# Altium schematic sheet Micro.SchDoc
size A; SheetNumber: 2; SheetTotal: 3
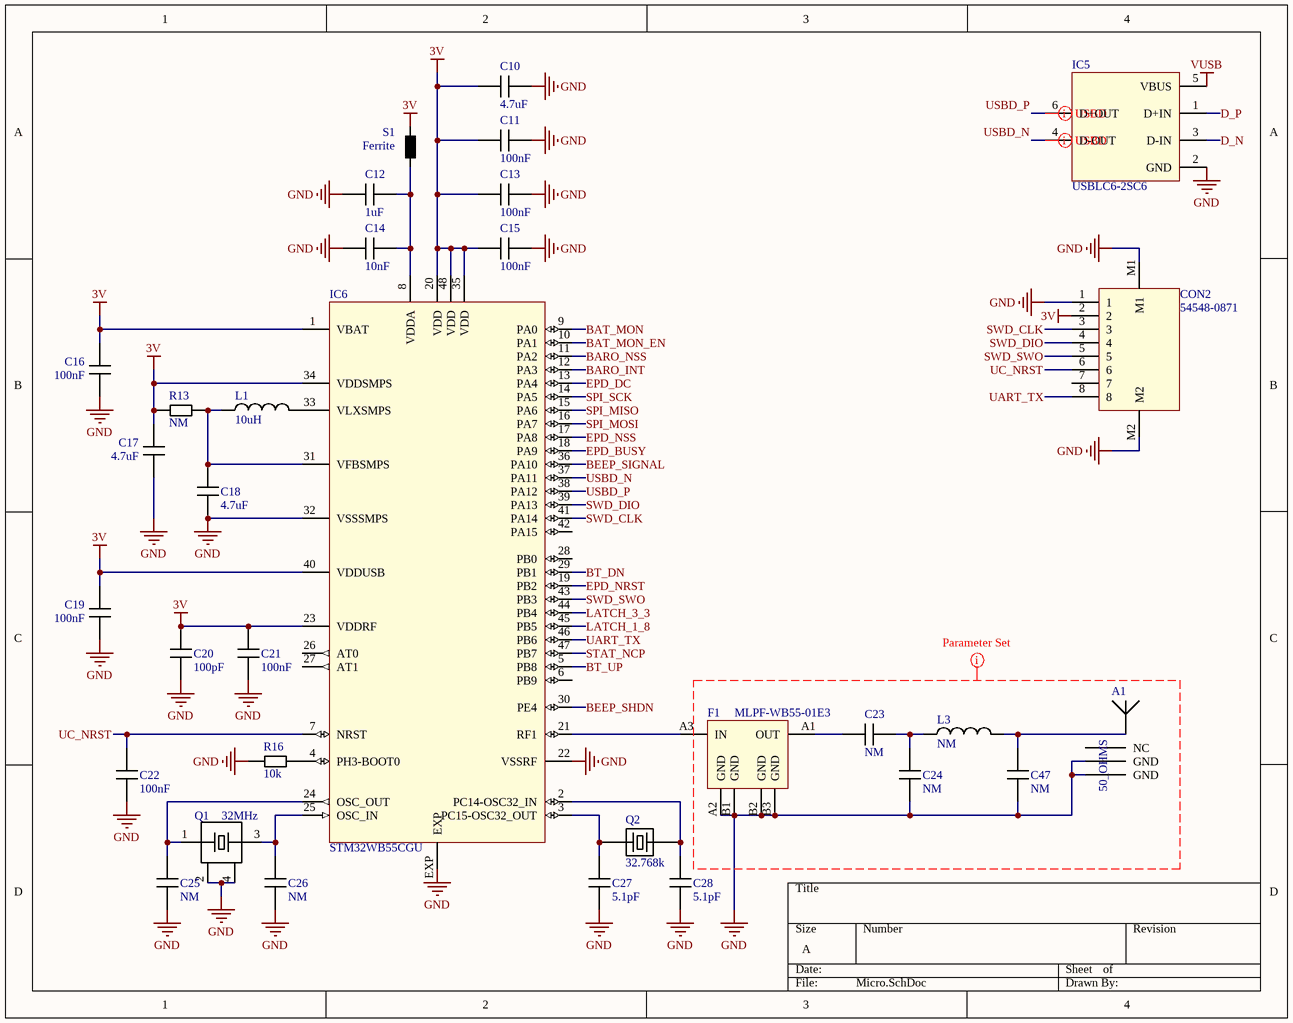
[diagram p0: Micro.SchDoc]

## Parts
A1  value 50_OHMS  [2450AT42E0100]  (hidden comment: 2450AT42E0100)
C10  value 4.7uF  [C0402]  (hidden comment: 4.7uF (0402) AEC-Q200)
C11  value 100nF  [C0402]  (hidden comment: 100nF (0402) AEC-Q200)
C12  value 1uF  [C0402]  (hidden comment: 1uF (0402))
C13  value 100nF  [C0402]  (hidden comment: 100nF (0402) AEC-Q200)
C14  value 10nF  [C0402]  (hidden comment: 10nF (0402) AEC-Q200)
C15  value 100nF  [C0402]  (hidden comment: 100nF (0402) AEC-Q200)
C16  value 100nF  [C0402]  (hidden comment: 100nF (0402) AEC-Q200)
C17  value 4.7uF  [C0402]  (hidden comment: 4.7uF (0402) AEC-Q200)
C18  value 4.7uF  [C0402]  (hidden comment: 4.7uF (0402) AEC-Q200)
C19  value 100nF  [C0402]  (hidden comment: 100nF (0402) AEC-Q200)
C20  value 100pF  [C0402]  (hidden comment: 100pF (0402) AEC-Q200)
C21  value 100nF  [C0402]  (hidden comment: 100nF (0402) AEC-Q200)
C22  value 100nF  [C0402]  (hidden comment: 100nF (0402) AEC-Q200)
C23  value NM  [C0402 (NM)]  (hidden comment: NM (0402))
C24  value NM  [C0402 (NM)]  (hidden comment: NM (0402))
C25  value NM  [C0402 (NM)]  (hidden comment: NM (0402))
C26  value NM  [C0402 (NM)]  (hidden comment: NM (0402))
C27  value 5.1pF  [C0402]  (hidden comment: 5.1pF (0402) AEC-Q200)
C28  value 5.1pF  [C0402]  (hidden comment: 5.1pF (0402) AEC-Q200)
C47  value NM  [C0402 (NM)]  (hidden comment: NM (0402))
CON2  54548-0871  [54548-0871]
F1  MLPF-WB55-01E3  [MLPF-WB-01E3]
IC5  value USBLC6-2SC6  [SOT23-6]  (hidden comment: USBLC6-2)
IC6  STM32WB55CGU  [UFQFPN48]
L1  value 10uH  [2.5x2 (2512)]  (hidden comment: 10uH (2.5x2) AEC-Q200)
L3  value NM  [S0402 (NM)]  (hidden comment: NM (0402))
Q1  value 32MHz  [2.0x1.6 - ECS-320-8-47Q]  (hidden comment: ECS-320-8-47Q-CES-TR)
Q2  value 32.768k  [3.2x1.5]  (hidden comment: ECS-.327-12.5-34QCS-TR)
R13  value NM  [R0402 (NM)]  (hidden comment: NM (0402))
R16  value 10k  [R0402]  (hidden comment: 10k (0402) AEC-Q200)
S1  value Ferrite  [0402 (FERRITE)]  (hidden comment: Ferrite (0402) 1k AEC-Q200)

## Nets
3V: C10.2 C11.1 C13.1 C15.1 C16.1 C17.2 C19.1 C20.1 C21.1 CON2.2 IC6.1(VBAT) IC6.20(VDD) IC6.23(VDDRF) IC6.34(VDDSMPS) IC6.35(VDD) IC6.40(VDDUSB) IC6.48(VDD) R13.1 S1.2
GND: A1.3(GND) A1.4(GND) C10.1 C11.2 C12.1 C13.2 C14.2 C15.2 C16.2 C17.1 C18.1 C19.2 C20.2 C21.2 C22.2 C24.2 C25.2 C26.2 C27.2 C28.2 C47.2 CON2.1 CON2.M1 CON2.M2 F1.A2(GND) F1.B1(GND) F1.B2(GND) F1.B3(GND) IC5.2(GND) IC6.22(VSSRF) IC6.32(VSSSMPS) IC6.EXP Q1.2 Q1.4 R16.1
VUSB: IC5.5(VBUS)
BARO_INT: IC6.12(PA3)
BARO_NSS: IC6.11(PA2)
BAT_MON: IC6.9(PA0)
BAT_MON_EN: IC6.10(PA1)
BEEP_SHDN: IC6.30(PE4)
BEEP_SIGNAL: IC6.36(PA10)
BT_DN: IC6.29(PB1)
BT_UP: IC6.5(PB8)
D_N: IC5.3(D-IN)
D_P: IC5.1(D+IN)
EPD_BUSY: IC6.18(PA9)
EPD_DC: IC6.13(PA4)
EPD_NRST: IC6.19(PB2)
EPD_NSS: IC6.17(PA8)
LATCH_1_8: IC6.45(PB5)
LATCH_3_3: IC6.44(PB4)
SPI_MISO: IC6.15(PA6)
SPI_MOSI: IC6.16(PA7)
SPI_SCK: IC6.14(PA5)
STAT_NCP: IC6.47(PB7)
SWD_CLK: CON2.3 IC6.41(PA14)
SWD_DIO: CON2.4 IC6.39(PA13)
SWD_SWO: CON2.5 IC6.43(PB3)
UART_TX: CON2.8 IC6.46(PB6)
UC_NRST: C22.1 CON2.6 IC6.7(NRST)
USBD_N: IC5.4(D-OUT) IC6.37(PA11)
USBD_P: IC5.6(D+OUT) IC6.38(PA12)
NetA1_1: A1.1 C47.1 L3.2
NetC12_2: C12.2 C14.1 IC6.8(VDDA) S1.1
NetC18_2: C18.2 IC6.31(VFBSMPS) L1.1 R13.2
NetC23_1: C23.1 F1.A1(OUT)
NetC23_2: C23.2 C24.1 L3.1
NetC25_1: C25.1 IC6.24(OSC_OUT) Q1.1(NC)
NetC26_1: C26.1 IC6.25(OSC_IN) Q1.3(GND)
NetC27_1: C27.1 IC6.3(PC15-OSC32_OUT) Q2.1
NetC28_1: C28.1 IC6.2(PC14-OSC32_IN) Q2.2
NetF1_A3: F1.A3(IN) IC6.21(RF1)
NetIC6_4: IC6.4(PH3-BOOT0) R16.2
NetIC6_33: IC6.33(VLXSMPS) L1.2

Not connected (* = marked no-connect by the designer): A1 2(NC); CON2 7; IC6 6(PB9) 26(AT0) 27(AT1) 28(PB0) 42(PA15)

## Layout directives
differential pair: USBD_N, USBD_P
net class RF; CompClassName: RF: (no net found under the mark)

## Library data of the parts
A1 = 2450AT42E0100: RF ANT 900MHZ HELICAL SOLDER SMD; Fabricant: PulseLarsen Antennas; Référence: 2450AT42E0100
C10 C17 C18 = 4.7uF (0402) AEC-Q200: X7T 0402 10% 6.3V AEC-Q200; Référence: KAM05CT70J475KH; Fabricant: KYOCERA AVX
C11 C13 C15 C16 C19 C21 C22 = 100nF (0402) AEC-Q200: X7R 0402 10% 50V AEC-Q200; Référence: GCM155R71H104KE02J; Fabricant: MURATA
C12 = 1uF (0402): X7S 10% 0402 16V; Fabricant: MURATA; Référence: GRM155C71C105KE11D
C14 = 10nF (0402) AEC-Q200: X7R 0402 10% 50V AEC-Q200; Fabricant: MURATA; Référence: GRT155R71H103KE01D
C20 = 100pF (0402) AEC-Q200: NP0 0402 5% 50V AEC-Q200; Référence: GCM1555C1H101JA16D; Fabricant: MURATA
C27 C28 = 5.1pF (0402) AEC-Q200: NP0 0402 5% 50V AEC-Q200; Fabricant: MURATA; Référence: GCM1555C1H5R1CA16D
CON2 = 54548-0871: Connecteur FFC/FPC, Right-Angle, Surface Mount, ZIF, Bottom Contact / Style, 30 Circuits; Fabricant: MOLEX; Référence: 54548-0871; Value: 54548-0871
F1 = MLPF-WB55-01E3: 2.4 GHz low pass filter matched to STM32WB55C; Fabricant: ST; Référence: MLPF-WB55-01E3; Value: MLPF-WB55-01E3
IC5 = USBLC6-2: Fabricant: ST; Référence: USBLC6-2SC6
IC6 = STM32WB55CGU: Fabricant: ST; Référence: STM32WB55CGU3; Value: STM32WB55CGU
L1 = 10uH (2.5x2) AEC-Q200: 20% 2.5x2 semi-blindé AEC-Q200; Fabricant: WURTH ELEKTRONIK; Référence: 74404024100; Supplier: Farnell; RefSupplier: 2431473
Q1 = ECS-320-8-47Q-CES-TR: Quartz 32MHz; Référence: ECS-320-10-37Q-ES-TR; Fabricant: ECS Inc.
Q2 = ECS-.327-12.5-34QCS-TR: Cristal, 32.768 kHz, CMS, 3.2mm x 1.5mm AEC-Q200; Fabricant: ECS; Référence: ECS-.327-12.5-34QCS-TR
R16 = 10k (0402) AEC-Q200: 1% 0402 0.1W 100ppm AEC-Q200; Référence: ERJ-2RKF1002X; Fabricant: PANASONIC
S1 = Ferrite (0402) 1k AEC-Q200: Perle de ferrite AEC-Q200; Fabricant: TDK; Référence: MMZ1005Y102CTD25